# EAGLE design Irdroino (EAGLE 6.5.0)
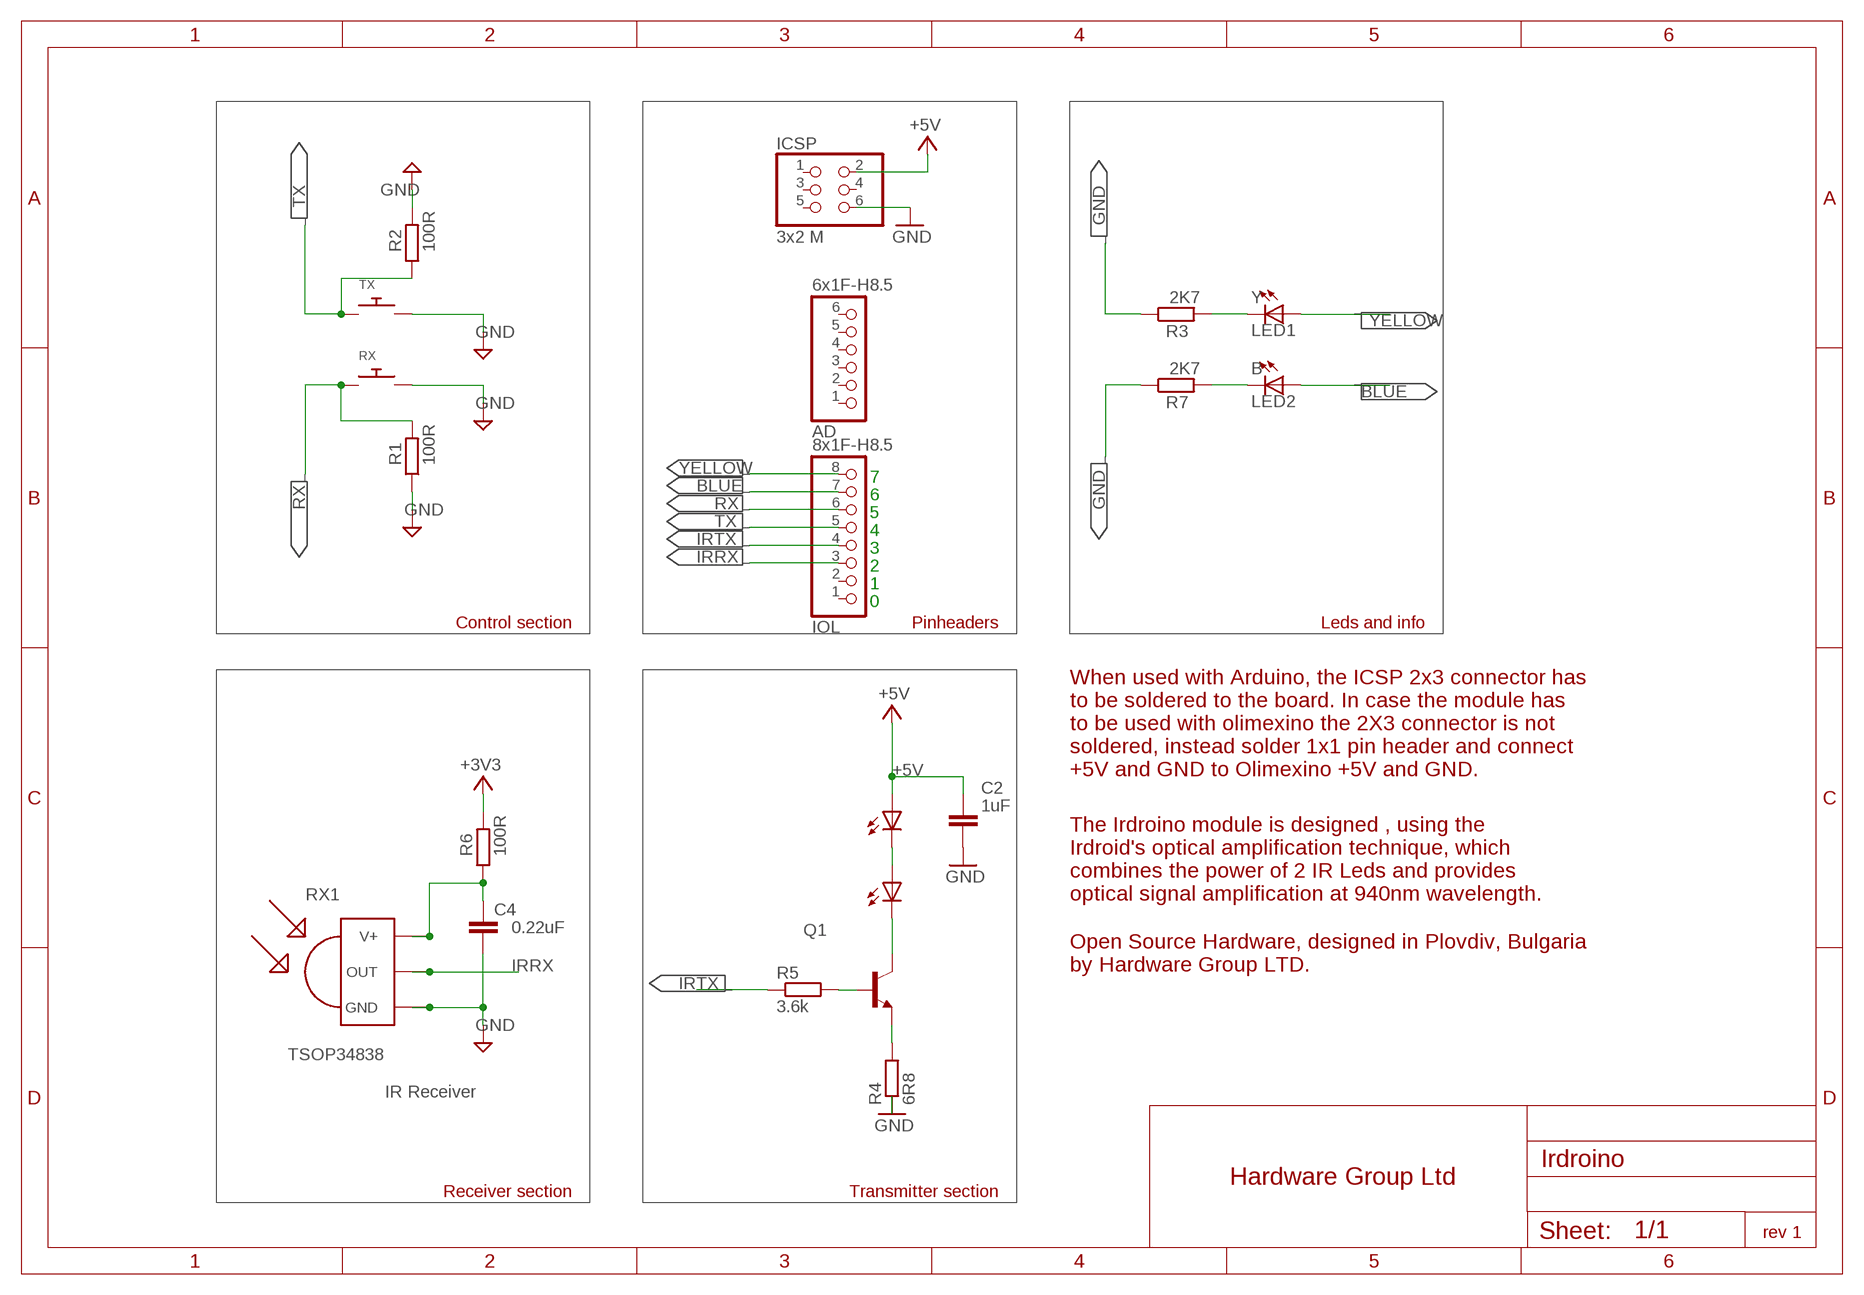
[diagram p0: schematic, sheet 1]

## Parts
AD  6x1F-H8.5  PINHD-1X6  [1X06]
B  LED2  LEDCHIP-LED0805  [CHIP-LED0805]
C2  1uF  CAPACITOR_NPOL-0603  [C603@1]
C4  0.22uF  CAPC603  [C603]
ICSP  3x2 M  PINHD-2X3  [2X03]
IOL  8x1F-H8.5  PINHD-1X8  [1X08]
Q1  TRANSISTOR_BJT_NPN-SOT-23-BCE  [SOT-23]
R1  100R  RESISTORR603  [R603]
R2  100R  RESISTORR603  [R603]
R3  2K7  RESISTORR603  [R603]
R4  6R8  R-EU_R1206  [R1206]
R5  3.6k  R-EU_R0603  [R0603]
R6  100R  RESISTORR603  [R603]
R7  2K7  RESISTORR603  [R603]
RX  SWITCH_PUSHBUTTONC&K_KSS  [BTN_CK_KSS]
RX1  TSOP34838  TSOP4838  [TSOP18XX]
TX  SWITCH_PUSHBUTTONC&K_KSS  [BTN_CK_KSS]
U$5  IRLED5MM  [IRLED_HOLDER]
U$7  IRLED5MM  [IRLED_HOLDER]
Y  LED1  LEDCHIP-LED0805  [CHIP-LED0805]

## Nets
+5V [usbvcc]: C2.1 ICSP.2 R6.2 U$7.A ; supply symbol labelled +3V3
A: Q1.2(C) U$5.K(C)
BLUE: B.A IOL.7
GND [gnd]: C2.2 C4.2 ICSP.6 R1.1 R2.2 R3.1 R4.1 R7.1 RX1.GND RX.P$2 TX.P$2
IRRX: IOL.3 RX1.OUT
IRTX: IOL.4 R5.1
K: Q1.3(E) R4.2
N$1: U$5.A U$7.K(C)
N$2: R3.2 Y.C
N$3: B.C R7.2
N$8: Q1.1(B) R5.2
N$10: C4.1 R6.1 RX1.VCC(V+)
RX: IOL.6 R1.2 RX.P$1
TX: IOL.5 R2.1 TX.P$1
YELLOW: IOL.8 Y.A
Unconnected: AD.1 AD.2 AD.3 AD.4 AD.5 AD.6 ICSP.1 ICSP.3 ICSP.4 ICSP.5 IOL.1 IOL.2

## Notes on the sheet
- 7
- 6
- 5
- 4
- 3
- 2
- 1
- 0
- Control section | Pinheaders | Leds and info
- When used with Arduino, the ICSP 2x3 connector has
  to be soldered to the board. In case the module has
  to be used with olimexino the 2X3 connector is not
  soldered, instead solder 1x1 pin header and connect
  +5V and GND to Olimexino +5V and GND.
- RX1
- The Irdroino module is designed , using the
  Irdroid's optical amplification technique, which
  combines the power of 2 IR Leds and provides
  optical signal amplification at 940nm wavelength.
- Open Source Hardware, designed in Plovdiv, Bulgaria
  by Hardware Group LTD.
- TSOP34838
- IR Receiver
- Receiver section | Transmitter section | Hardware Group Ltd
- rev 1

## Library data of the parts
AD = SmartPrj:PINHD-1X6: PIN HEADER
B Y = led:LED: LED OSRAM: - CHIPLED LG R971, LG N971, LY N971, LG Q971, LY Q971, LO R971, LY R971 LH N974, LH R974 LS Q976, LO Q976, LY Q976 LO Q996 - Hyper CHIPLED LW Q18S LB Q993, LB Q99A, LB R99A - SideLED LS A670, LO A670, LY A670, LG A670, LP A670 LB A673, LV A673, LT A673, LW A673 LH A674 LY A675 LS A676, LA A676, LO A676, LY A676, LW A676 LS A679, LY A679, LG A679 - Hyper Micro SIDELED® LS Y876, LA Y876, LO Y876, LY Y876 LT Y87S - SmartLED LW L88C, LW L88S LB L89C, LB L89S, LG L890 LS L89K, LO L89K, LY L89K LS L896, LA L896, LO L896, LY L896 - TOPLED LS T670, LO T670, LY T670, LG T670, LP T670 LSG T670, LSP T670, LSY T670, LOP T670, LYG T670 LG T671, LOG T671, LSG T671 LB T673, LV T673, LT T673, LW T673 LH T674 LS T676, LA T676, LO T676, LY T676, LB T676, LH T676, LSB T676, LW T676 LB T67C, LV T67C, LT T67C, LS T67K, LO T67K, LY T67K, LW E67C LS E67B, LA E67B, LO E67B, LY E67B, LB E67C, LV E67C, LT E67C LW T67C LS T679, LY T679, LG T679 LS T770, LO T770, LY T770, LG T770, LP T770 LB T773, LV T773, LT T773, LW T773 LH T774 LS E675, LA E675, LY E675, LS T675 LS T776, LA T776, LO T776, LY T776, LB T776 LHGB T686 LT T68C, LB T68C - Hyper Mini TOPLED® LB M676 - Mini TOPLED Santana® LG M470 LS M47K, LO M47K, LY M47K Source: http://www.osram.convergy.de LUXEON: - LUMILED® LXK2-PW12-R00, LXK2-PW12-S00, LXK2-PW14-U00, LXK2-PW14-V00 LXK2-PM12-R00, LXK2-PM12-S00, LXK2-PM14-U00 LXK2-PE12-Q00, LXK2-PE12-R00, LXK2-PE12-S00, LXK2-PE14-T00, LXK2-PE14-U00 LXK2-PB12-K00, LXK2-PB12-L00, LXK2-PB12-M00, LXK2-PB14-N00, LXK2-PB14-P00, LXK2-PB14-Q00 LXK2-PR12-L00, LXK2-PR12-M00, LXK2-PR14-Q00, LXK2-PR14-R00 LXK2-PD12-Q00, LXK2-PD12-R00, LXK2-PD12-S00 LXK2-PH12-R00, LXK2-PH12-S00 LXK2-PL12-P00, LXK2-PL12-Q00, LXK2-PL12-R00 Source: www.luxeon.com KINGBRIGHT: KA-3528ASYC Source: www.kingbright.com
C2 = dp_devices:CAPACITOR_NPOL: Non-Polarized capacitor in various packages
C4 = dp_devices:CAP
ICSP = SmartPrj:PINHD-2X3: PIN HEADER
IOL = SmartPrj:PINHD-1X8: PIN HEADER
Q1 = dp_devices:TRANSISTOR_BJT_NPN: Most commonly used is SOT23-BEC
R1-R3 R6 R7 = dp_devices:RESISTOR
R4 R5 = resistor:R-EU_: RESISTOR, European symbol
RX TX = adafruit:SWITCH_PUSHBUTTON: Buttons SOFTTOUCHSMD_SJ - Soft touch temporary push button (Super Junk Akihabara) Compatible with SKPMANE010 [Mouser: 688-SKPMAN] C&K_KSS = Digikey: KSS221GLFS
RX1 = tsop:TSOP4838: IR Receiver and Demodulator
U$5 U$7 = IRLED_holder:IRLED5MM

## Net classes
1 power: width 0.61 mm, drill 0.61 mm, clearance 0.254 mm
2 gnd: width 0.305 mm, drill 0.559 mm, clearance 0.254 mm
3 usbvcc: width 0.305 mm, drill 0.61 mm, clearance 0.254 mm
4 aref: width 0.406 mm, drill 0.61 mm, clearance 0.254 mm

## Board
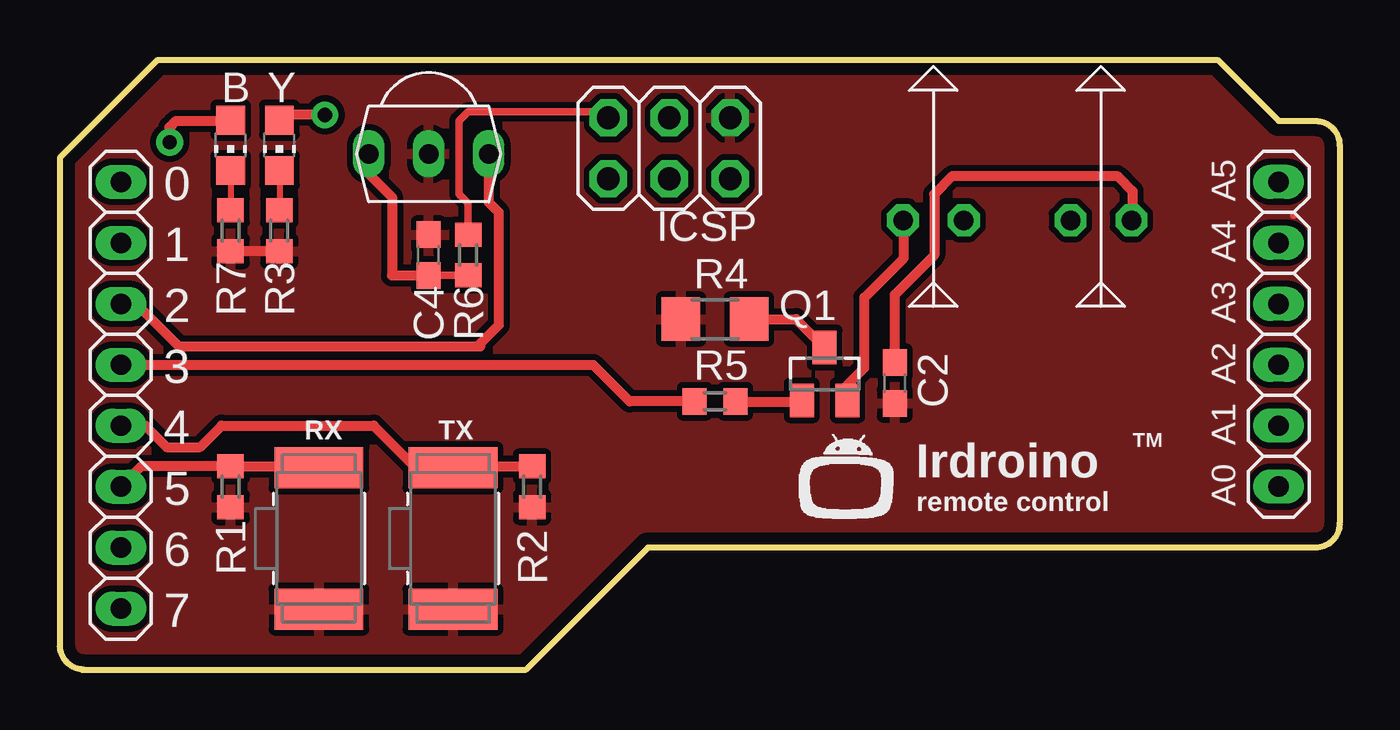
[diagram p1: board, top side]
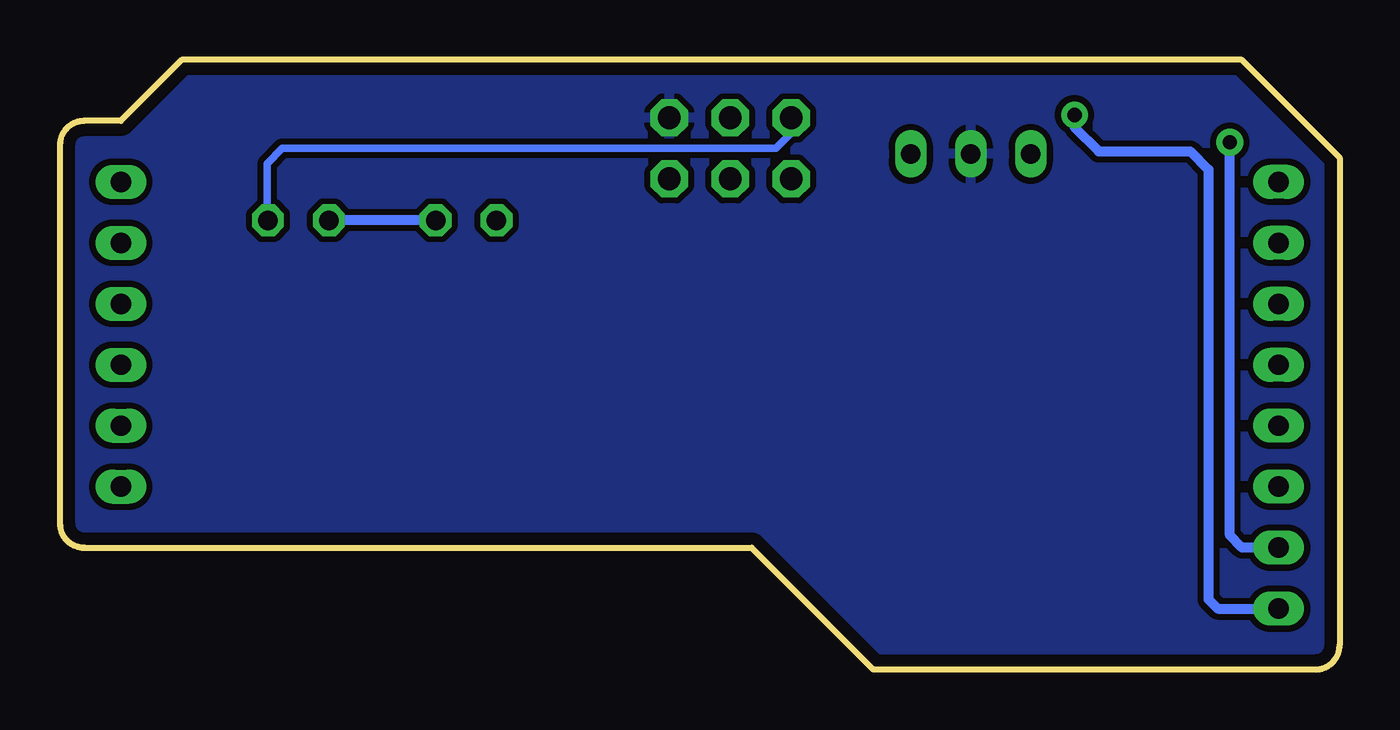
[diagram p2: board, bottom side, seen from below]

Size 53.34 x 25.4 mm. Coordinates in mm from the lower left corner, seen from the top.
Outline: 53.34,21.86 arc90 52.34,22.86 50.8,22.86 48.26,25.4 4.06,25.4 0,21.34 0,1.02
Outline: 53.34,6.08 arc-90 52.34,5.08
Outline: 1,0 arc-90 0,1
Outline: 0.89,0 19.43,0 24.51,5.08 52.32,5.08
Outline: 53.34,21.84 53.34,6.1
Copper layers (1*16): Top 0.035mm / dielectric 1.5mm / Bottom 0.035mm
Design rules "default *": minimum track width 10mil, minimum drill 22mil, track to track 10mil, track to pad 10mil, pad to pad 10mil, via to via 12mil, smd to smd 8mil, copper to edge 20mil, drill to drill 12mil, minimum pad ring 10mil, minimum via ring 10mil, stop-mask expansion 1mil, vias tented up to drill 30mil, thermal gap 10mil
vRestrict: area 17.5,18.8 to 19.3,23.9; area 20.1,20.2 to 21.7,23.9; area 23.1,20.1 to 24.3,23.5; area 25.7,20.1 to 26.8,23.5; area 28.2,20.1 to 29.3,23.5; area 30.7,20.1 to 31.9,23.5; area 33.4,22 to 34.5,23.5; area 34.9,19.8 to 42.3,21.6; area 55,18.9 to 56.4,21.5; area 57.5,18.9 to 58.9,21.5; area 56,10.5 to 59.4,11.9; area -4.7,-3.4 to -3.3,4.8; 14 more areas

### Footprints (pad centres in the part's own frame; a part is rotated, then mirrored left to right if it is on the bottom)
1X06 = drill 0.85 pad 1.422 long: 1 -6.35,0; 2 -3.81,0; 3 -1.27,0; 4 1.27,0; 5 3.81,0; 6 6.35,0
CHIP-LED0805 = smd 1.2 x 1.2: A 0,-1.05; C 0,1.05
C603@1 = smd 1.1 x 1: 1 -0.85,0; 2 0.85,0
C603 = smd 1.1 x 1: 1 -0.85,0; 2 0.85,0
2X03 = drill 0.95 pad 1.55 octagon: 1 -2.54,-1.27; 2 -2.54,1.27; 3 0,-1.27; 4 0,1.27; 5 2.54,-1.27; 6 2.54,1.27
1X08 = drill 0.85 pad 1.422 long: 1 -8.89,0; 2 -6.35,0; 3 -3.81,0; 4 -1.27,0; 5 1.27,0; 6 3.81,0; 7 6.35,0; 8 8.89,0
SOT-23 = smd 1 x 1.4: 1 -0.95,-1.1; 2 0.95,-1.1; 3 0,1.1
R603 = smd 1 x 1.1: 1 -0.85,0; 2 0.85,0
R1206 = smd 1.6 x 1.803: 1 -1.422,0; 2 1.422,0
R0603 = smd 1 x 1.1: 1 -0.85,0; 2 0.85,0
BTN_CK_KSS = smd 1.7 x 3.7: P$1 -2.95,0; P$2 2.95,0
TSOP18XX = drill 0.813 long: GND -0.001,-0.027; OUT -2.501,-0.027; VCC 2.499,-0.027
IRLED_HOLDER = drill 0.813 octagon: A 5.41,4.28; K 5.41,1.74

### Placement (x,y rotation side)
AD  50.8,13.97 90 top
B  7.11,21.84 180 top
C2  34.8,11.94 270 top
C4  15.37,17.27 90 top
ICSP  25.4,21.72 0 top
IOL  2.54,11.43 270 top
Q1  31.88,12.32 0 top
R1  7.11,7.62 90 top
R2  19.68,7.62 270 top
R3  9.14,18.29 90 top
R4  27.31,14.61 0 top
R5  27.31,11.18 0 top
R6  17.02,17.27 90 top
R7  7.11,18.29 90 top
RX  10.8,5.46 270 top
RX1  15.37,21.46 180 top
TX  16.38,5.46 270 top
U$2  [IRDROIDLOGO]  30.5,6.01 0 top
U$5  33.4,24.13 270 top
U$7  40.39,24.13 270 top
Y  9.14,21.84 180 top

### Tracks (layer width: path | path; a pad name or v marks a point on that pad's centre or on a via)
+5V
  Top 0.305: ICSP.2 22.61,23.24 17.02,23.24 16.64,22.86 16.64,19.81 17.02,19.43 R6.2
  Top 0.406: C2.1 34.8,15.62 36.45,17.27 36.45,19.81 37.21,20.57 44.07,20.57 44.7,19.94 44.7,19.39 U$7.A
  Bottom 0.305: ICSP.2 22.86,22.35 23.5,21.72 44.07,21.72 44.7,21.08 44.7,18.76 U$7.A 44.7,19.39
A
  Top 0.406: Q1.2 32.83,11.87 33.53,12.57 33.53,15.49 35.18,17.14 35.18,18.68 U$5.K
BLUE  (via drill 0.6)
  Top 0.406: v4.57,21.97 4.57,22.61 4.83,22.86 7.08,22.86 B.A
  Bottom 0.406: IOL.7 4.06,5.08 4.57,5.59 v4.57,21.97
GND
  Top 0.305: R3.1 9.1,17.49 | 51.44,18.92 51.44,18.93 | 9.73,1.86 RX.P$2
  Top 0.406: R3.1 R7.1
  pour Top: 48.26,25.4 50.8,22.86 52.58,22.86 53.34,22.1 53.34,5.71 52.58,4.95 24.38,4.95 19.43,0 0.64,0 0,0.64 0,21.34 4.06,25.4
  pour Bottom: 4.06,25.4 48.26,25.4 50.8,22.86 52.58,22.86 53.34,22.1 53.34,5.59 52.7,4.95 24.38,4.95 19.43,0 0.64,0 0,0.64 0,21.34
IRRX
  Top 0.406: IOL.3 3.18,15.24 4.95,13.46 17.4,13.46 | 17.4,13.46 17.53,13.46 | RX1.OUT 17.87,19.47 18.29,19.05 18.29,14.35 17.4,13.46
IRTX
  Top 0.406: R5.1 23.75,11.18 22.23,12.7 IOL.4
K
  Top 0.406: R4.2 30.69,14.61 Q1.3
N$1
  Bottom 0.406: U$5.A U$7.K
N$2
  Top 0.254: R3.2 Y.C
N$3
  Top 0.254: R7.2 B.C
N$8
  Top 0.406: Q1.1 30.85,11.14 28.19,11.14 R5.2
N$10
  Top 0.305: R6.1 C4.1
  Top 0.406: C4.1 13.84,16.42 13.84,19.68 12.87,20.66 RX1.VCC
RX
  Top 0.406: IOL.6 3.39,8.47 R1.2 10.74,8.47 RX.P$1 10.48,8.47
TX
  Top 0.406: R2.1 16.7,8.47 TX.P$1 15.08,8.16 13.08,10.16 6.73,10.16 5.84,9.27 4.45,9.27 3.56,10.16 IOL.5
YELLOW  (via drill 0.6)
  Top 0.406: v11.05,23.11 9.36,23.11 Y.A
  Bottom 0.406: v11.05,23.11 11.05,22.61 10.03,21.59 6.22,21.59 5.46,20.83 5.46,2.92 5.08,2.54 IOL.8

### Text on the board
tPlace: 0 | 1 | 2 | 3 | 4 | 5 | 6 | 7
tNames: A5 | A4 | A3 | A2 | TM | A1 | Irdroino | remote control | A0
ReferenceLC: L | TX | ON | RX | PC1 | PC2
214bmp: D:/SmartProjects/Snc/a4_bn_logo2.bmp